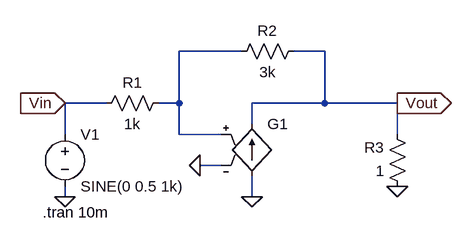
[diagram p0: schematic Prob_3a.asc]
Prob_3a.asc, the LTspice schematic file:
Version 4
SHEET 1 880 680
WIRE 352 16 256 16
WIRE 480 16 432 16
WIRE 144 96 80 96
WIRE 256 96 256 16
WIRE 256 96 224 96
WIRE 480 96 480 16
WIRE 480 96 368 96
WIRE 592 96 480 96
WIRE 368 128 368 96
WIRE 80 144 80 96
WIRE 256 144 256 96
WIRE 320 144 256 144
WIRE 592 144 592 96
WIRE 320 192 288 192
WIRE 80 240 80 224
WIRE 368 240 368 208
FLAG 80 240 0
FLAG 592 224 0
FLAG 368 240 0
FLAG 288 192 0
FLAG 592 96 Vout
IOPIN 592 96 Out
FLAG 80 96 Vin
IOPIN 80 96 In
SYMBOL voltage 80 128 R0
WINDOW 123 0 0 Left 0
WINDOW 39 0 0 Left 0
SYMATTR InstName V1
SYMATTR Value SINE(0 0.5 1k)
SYMBOL res 240 80 R90
WINDOW 0 0 56 VBottom 2
WINDOW 3 32 56 VTop 2
SYMATTR InstName R1
SYMATTR Value 1k
SYMBOL res 448 0 R90
WINDOW 0 0 56 VBottom 2
WINDOW 3 32 56 VTop 2
SYMATTR InstName R2
SYMATTR Value 3k
SYMBOL res 608 240 R180
WINDOW 0 36 76 Left 2
WINDOW 3 36 40 Left 2
SYMATTR InstName R3
SYMATTR Value 1
SYMBOL g 368 112 R0
WINDOW 3 24 96 Invisible 2
SYMATTR InstName G1
SYMATTR Value 1Meg
TEXT 46 264 Left 2 !.tran 10m

The netlist it stands for:
* Prob_3a.asc
V1 Vin 0 SINE(0 0.5 1k)
R1 N001 Vin 1k
R2 Vout N001 3k
R3 0 Vout 1
G1 0 Vout N001 0 1Meg
.tran 10m
.backanno
.end

* Results of the author's LTspice run, read from the files saved beside the schematic
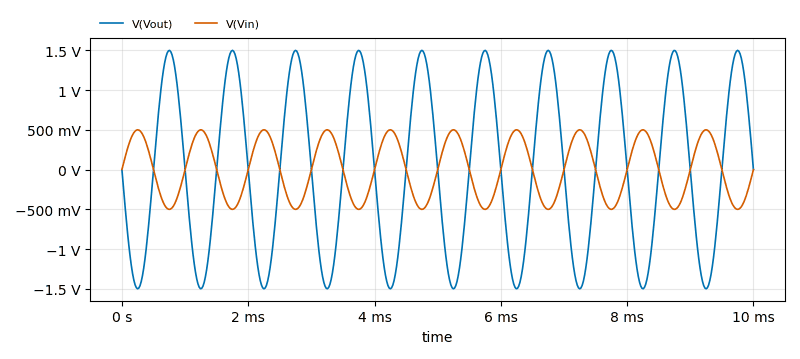
[diagram p1: Transient Analysis of Prob_3a.asc, plotted from the saved traces]
* Transient Analysis, 1 run:
*   V(Vout): min -1.499 V, max 1.499 V, average 0 V, rms 1.06 V, last 0 V
*   V(Vin): min -500 mV, max 500 mV, average 0 V, rms 353.6 mV, last 0 V